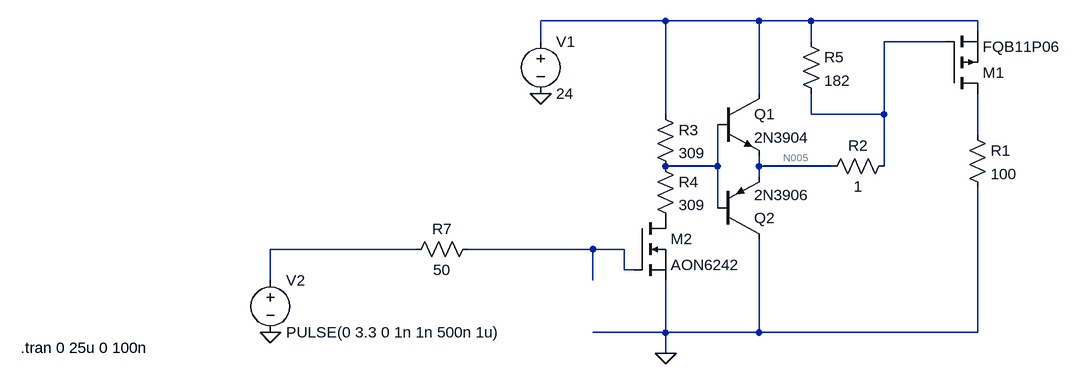
[diagram p0: schematic gate_driver.asc]
gate_driver.asc, the LTspice schematic file:
Version 4
SHEET 1 880 680
WIRE 48 -16 -144 -16
WIRE 192 -16 48 -16
WIRE 272 -16 192 -16
WIRE 528 -16 272 -16
WIRE 528 0 528 -16
WIRE -144 16 -144 -16
WIRE 272 16 272 -16
WIRE 480 16 384 16
WIRE 192 96 192 -16
WIRE 48 128 48 -16
WIRE 272 128 272 96
WIRE 384 128 384 16
WIRE 384 128 272 128
WIRE 528 160 528 96
WIRE 128 208 128 144
WIRE 128 208 48 208
WIRE 192 208 192 192
WIRE 304 208 192 208
WIRE 384 208 384 128
WIRE 192 224 192 208
WIRE 128 272 128 208
WIRE -336 336 -560 336
WIRE -64 336 -256 336
WIRE -16 336 -64 336
WIRE -16 368 -16 336
WIRE 0 368 -16 368
WIRE -560 384 -560 336
WIRE -64 384 -64 336
WIRE 48 464 48 384
WIRE 48 464 -64 464
WIRE 192 464 192 320
WIRE 192 464 48 464
WIRE 528 464 528 240
WIRE 528 464 192 464
WIRE 48 496 48 464
FLAG 48 496 0
FLAG -144 96 0
FLAG -560 464 0
SYMBOL npn 128 96 R0
SYMATTR InstName Q1
SYMATTR Value 2N3904
SYMBOL pnp 128 320 M180
SYMATTR InstName Q2
SYMATTR Value 2N3906
SYMBOL pmos 480 96 M180
SYMATTR InstName M1
SYMATTR Value FQB11P06
SYMBOL res 512 144 R0
SYMATTR InstName R1
SYMATTR Value 100
SYMBOL res 400 192 R90
WINDOW 0 0 56 VBottom 2
WINDOW 3 32 56 VTop 2
SYMATTR InstName R2
SYMATTR Value 1
SYMBOL res 32 112 R0
SYMATTR InstName R3
SYMATTR Value 309
SYMBOL res 32 192 R0
SYMATTR InstName R4
SYMATTR Value 309
SYMBOL res -240 320 R90
WINDOW 0 0 56 VBottom 2
WINDOW 3 32 56 VTop 2
SYMATTR InstName R7
SYMATTR Value 50
SYMBOL voltage -144 0 R0
WINDOW 123 0 0 Left 2
WINDOW 39 0 0 Left 2
SYMATTR InstName V1
SYMATTR Value 24
SYMBOL voltage -560 368 R0
WINDOW 123 0 0 Left 2
WINDOW 39 0 0 Left 2
SYMATTR InstName V2
SYMATTR Value PULSE(0 3.3 0 1n 1n 500n 1u)
SYMBOL nmos 0 288 R0
SYMATTR InstName M2
SYMATTR Value AON6242
SYMBOL res 256 0 R0
SYMATTR InstName R5
SYMATTR Value 182
TEXT -944 488 Left 2 !.tran 0 25u 0 100n

The netlist it stands for:
* gate_driver.asc
Q1 N001 N004 N005 0 2N3904
Q2 0 N004 N005 0 2N3906
M1 N003 N002 N001 N001 FQB11P06
R1 N003 0 100
R2 N002 N005 1
R3 N001 N004 309
R4 N004 P001 309
R7 N007 N006 50
V1 N001 0 24
V2 N006 0 PULSE(0 3.3 0 1n 1n 500n 1u)
M2 P001 N007 0 0 AON6242
R5 N001 N002 182
.model NPN NPN
.model PNP PNP
.lib standard.bjt
.model NMOS NMOS
.model PMOS PMOS
.lib standard.mos
.tran 0 25u 0 100n
.backanno
.end

* Results of the author's LTspice run, read from the files saved beside the schematic
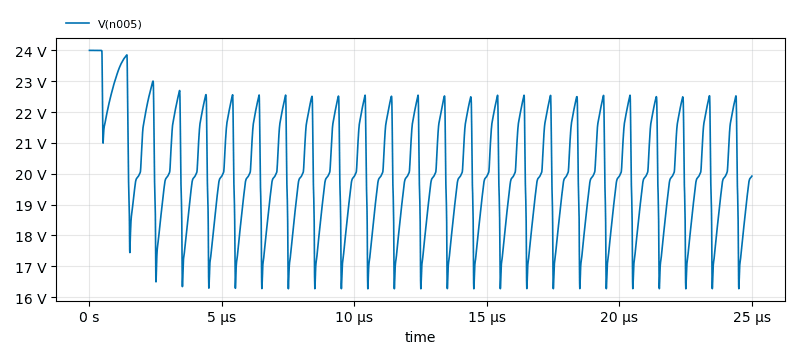
[diagram p1: Transient Analysis of gate_driver.asc, plotted from the saved traces]
* Transient Analysis, 1 run:
*   V(n005): min 16.27 V, max 24 V, average 20.06 V, rms 20.14 V, last 19.92 V